# Altium schematic sheet 1_MCU.schdoc
size 307 x 218 mm; Symbol: Drawing-Symbol_A4; Device: Drawing-Symbol_A4; Company: 嘉立创EDA; Version: V1.0; Page Size: A4; @Project Name: 工程文件; @Page Count: 7; @Update Date: 2025-06-16; @Create Date: 2025-06-12; @Schematic Name: Schematic1; @Page No: 1; @Page Name: MCU; @Create Time: 02:25:23; @Update Time: 11:01:51; Width: 1170; Height: 825; Region Start: 1; X Region Count: 6; Y Region Count: 4; Blade Width: 10; Title Block Position: 3; @Board Name: Board1
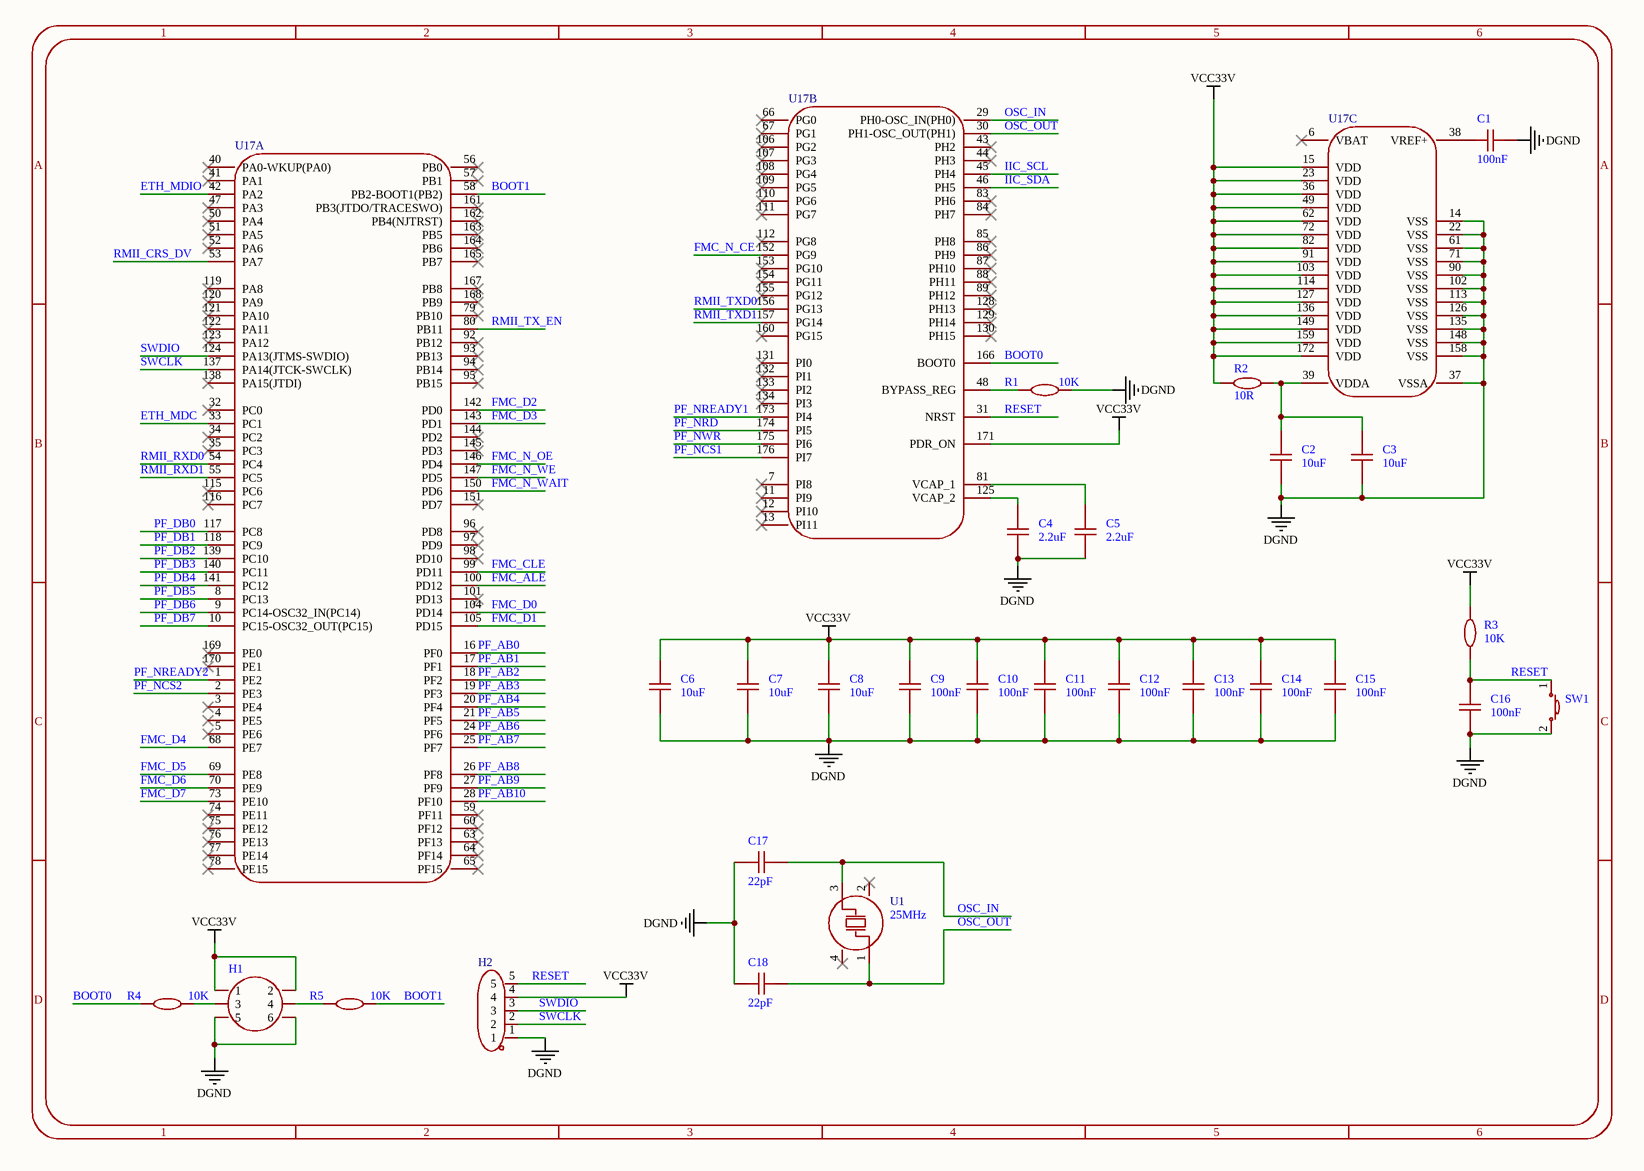
[diagram p0: 1_MCU.schdoc]

## Parts
C1  100nF  [C0402]
C2  10uF  [C0603]
C3  10uF  [C0603]
C4  2.2uF  [C0402]
C5  2.2uF  [C0402]
C6  10uF  [C0603]
C7  10uF  [C0603]
C8  10uF  [C0603]
C9  100nF  [C0402]
C10  100nF  [C0402]
C11  100nF  [C0402]
C12  100nF  [C0402]
C13  100nF  [C0402]
C14  100nF  [C0402]
C15  100nF  [C0402]
C16  100nF  [C0402]
C17  22pF  [C0402]
C18  22pF  [C0402]
H1  (no value)  [HDR-TH_6P-P2.54-V-R2-C3-S2.54_A2541WV-2X3P]
H2  (no value)  [HDR-TH_5P-P2.54-V-M]
R1  10K  [R0402]
R2  10R  [R0402]
R3  10K  [R0402]
R4  10K  [R0402]
R5  10K  [R0402]
SW1  (no value)  [Key_SMD_3x4x2]
U1  25MHz  [CRYSTAL-SMD_4P-L3.2-W2.5-TR]
U17  (no value)  [LQFP-176_L24.0-W24.0-P0.50-LS26.0-BL]  (parts A,B,C of 3)

## Nets
DGND: C1.1 C2.1 C3.1 C4.1 C5.1 C6.1 C7.1 C8.1 C9.1 C10.1 C11.1 C12.1 C13.1 C14.1 C15.1 C16.1 C17.2 C18.2 H1.5 H1.6 H2.1 R1.1 SW1.2 U17.14(VSS) U17.22(VSS) U17.37(VSSA) U17.61(VSS) U17.71(VSS) U17.90(VSS) U17.102(VSS) U17.113(VSS) U17.126(VSS) U17.135(VSS) U17.148(VSS) U17.158(VSS)
VCC33V: C6.2 C7.2 C8.2 C9.2 C10.2 C11.2 C12.2 C13.2 C14.2 C15.2 H1.1 H1.2 H2.4 R2.2 R3.2 U17.15(VDD) U17.23(VDD) U17.36(VDD) U17.49(VDD) U17.62(VDD) U17.72(VDD) U17.82(VDD) U17.91(VDD) U17.103(VDD) U17.114(VDD) U17.127(VDD) U17.136(VDD) U17.149(VDD) U17.159(VDD) U17.171(PDR_ON) U17.172(VDD)
BOOT0: R4.1 U17.166(BOOT0)
BOOT1: R5.2 U17.58(PB2-BOOT1(PB2))
ETH_MDC: U17.33(PC1)
ETH_MDIO: U17.42(PA2)
FMC_ALE: U17.100(PD12)
FMC_CLE: U17.99(PD11)
FMC_D0: U17.104(PD14)
FMC_D1: U17.105(PD15)
FMC_D2: U17.142(PD0)
FMC_D3: U17.143(PD1)
FMC_D4: U17.68(PE7)
FMC_D5: U17.69(PE8)
FMC_D6: U17.70(PE9)
FMC_D7: U17.73(PE10)
FMC_N_CE: U17.152(PG9)
FMC_N_OE: U17.146(PD4)
FMC_N_WAIT: U17.150(PD6)
FMC_N_WE: U17.147(PD5)
IIC_SCL: U17.45(PH4)
IIC_SDA: U17.46(PH5)
OSC_IN: C17.1 U1.3(OSC2) U17.29(PH0-OSC_IN(PH0))
OSC_OUT: C18.1 U1.1(OSC1) U17.30(PH1-OSC_OUT(PH1))
PF_AB0: U17.16(PF0)
PF_AB1: U17.17(PF1)
PF_AB2: U17.18(PF2)
PF_AB3: U17.19(PF3)
PF_AB4: U17.20(PF4)
PF_AB5: U17.21(PF5)
PF_AB6: U17.24(PF6)
PF_AB7: U17.25(PF7)
PF_AB8: U17.26(PF8)
PF_AB9: U17.27(PF9)
PF_AB10: U17.28(PF10)
PF_DB0: U17.117(PC8)
PF_DB1: U17.118(PC9)
PF_DB2: U17.139(PC10)
PF_DB3: U17.140(PC11)
PF_DB4: U17.141(PC12)
PF_DB5: U17.8(PC13)
PF_DB6: U17.9(PC14-OSC32_IN(PC14))
PF_DB7: U17.10(PC15-OSC32_OUT(PC15))
PF_NCS1: U17.176(PI7)
PF_NCS2: U17.2(PE3)
PF_NRD: U17.174(PI5)
PF_NREADY1: U17.173(PI4)
PF_NREADY2: U17.1(PE2)
PF_NWR: U17.175(PI6)
RESET: C16.2 H2.5 R3.1 SW1.1 U17.31(NRST)
RMII_CRS_DV: U17.53(PA7)
RMII_RXD0: U17.54(PC4)
RMII_RXD1: U17.55(PC5)
RMII_TX_EN: U17.80(PB11)
RMII_TXD0: U17.156(PG13)
RMII_TXD1: U17.157(PG14)
SWCLK: H2.2 U17.137(PA14(JTCK-SWCLK))
SWDIO: H2.3 U17.124(PA13(JTMS-SWDIO))
NetC1_2: C1.2 U17.38(VREF+)
NetC2_2: C2.2 C3.2 R2.1 U17.39(VDDA)
NetC4_2: C4.2 U17.125(VCAP_2)
NetC5_2: C5.2 U17.81(VCAP_1)
NetH1_3: H1.3 R4.2
NetH1_4: H1.4 R5.1
NetR1_2: R1.2 U17.48(BYPASS_REG)

Not connected (* = marked no-connect by the designer): U1 2(GND)* 4(GND)*; U17 3(PE4)* 4(PE5)* 5(PE6)* 6(VBAT)* 7(PI8)* 11(PI9)* 12(PI10)* 13(PI11)* 32(PC0)* 34(PC2)* 35(PC3)* 40(PA0-WKUP(PA0))* 41(PA1)* 43(PH2)* 44(PH3)* 47(PA3)* 50(PA4)* 51(PA5)* 52(PA6)* 56(PB0)* 57(PB1)* 59(PF11)* 60(PF12)* 63(PF13)* 64(PF14)* 65(PF15)* 66(PG0)* 67(PG1)* 74(PE11)* 75(PE12)* 76(PE13)* 77(PE14)* 78(PE15)* 79(PB10)* 83(PH6)* 84(PH7)* 85(PH8)* 86(PH9)* 87(PH10)* 88(PH11)* 89(PH12)* 92(PB12)* 93(PB13)* 94(PB14)* 95(PB15)* 96(PD8)* 97(PD9)* 98(PD10)* 101(PD13)* 106(PG2)* 107(PG3)* 108(PG4)* 109(PG5)* 110(PG6)* 111(PG7)* 112(PG8)* 115(PC6)* 116(PC7)* 119(PA8)* 120(PA9)* 121(PA10)* 122(PA11)* 123(PA12)* 128(PH13)* 129(PH14)* 130(PH15)* 131(PI0)* 132(PI1)* 133(PI2)* 134(PI3)* 138(PA15(JTDI))* 144(PD2)* 145(PD3)* 151(PD7)* 153(PG10)* 154(PG11)* 155(PG12)* 160(PG15)* 161(PB3(JTDO/TRACESWO))* 162(PB4(NJTRST))* 163(PB5)* 164(PB6)* 165(PB7)* 167(PB8)* 168(PB9)* 169(PE0)* 170(PE1)*

## Notes on the sheet
- 1
- 2
- 3
- 4
- 5
- 6
- A
- B
- C
- D

## Library data of the parts
C1 C4 C5 C9-C18 = CAP_0402: Symbol: CapAcitance; Convert to PCB: yes; Device: CAP_0402; Add into BOM: yes
  C1 C9-C16: Value: 100nF
  C4 C5: Value: 2.2uF
  C17 C18: Value: 22pF
C2 C3 C6-C8 = CAP_0603: Symbol: CapAcitance; Convert to PCB: yes; Device: CAP_0603; Add into BOM: yes; Value: 10uF
H1 = HDR-M_2.54_2x3: Symbol: HDR-M-2.54_2x3; Convert to PCB: yes; Device: HDR-M_2.54_2x3; Add into BOM: yes
H2 = HDR-M_2.54_1x5P: Symbol: MTP125-1105S1; Convert to PCB: yes; Device: HDR-M_2.54_1x5P; Add into BOM: yes
R1-R5 = Res_0402: Symbol: 电阻; Convert to PCB: yes; Device: Res_0402; Add into BOM: yes
  R1 R3-R5: Value: 10K
  R2: Value: 10R
SW1 = Key_SMD_3x4x2: Symbol: 轻触按键x2; Convert to PCB: yes; Device: Key_SMD_3x4x2; Add into BOM: yes; Supplier Footprint: SMD
U1 = 25MHz: Add into BOM: yes; Symbol: 25MHZ; Device: 25MHz; Manufacturer Part: 25MHz; Convert to PCB: yes
U17 = STM32F429IGT6: Add into BOM: yes; Relevance: []; Symbol: STM32F429IGT6; Device: STM32F429IGT6; Convert to PCB: yes; Applications: -